# Altium schematic sheet Ecran.SchDoc
size A
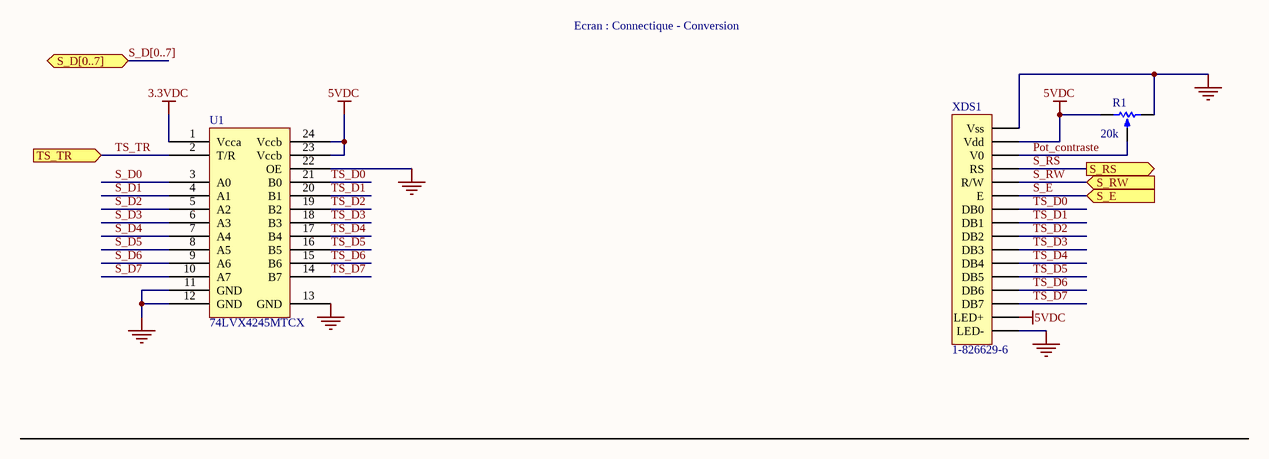
[diagram p0: Ecran.SchDoc]

## Parts
R1  20k  [VR5]
U1  74LVX4245MTCX
XDS1  1-826629-6  [HDR1X16]

## Ports
S_D[0..7] (bidir), S_E (in), S_RS (out), S_RW (in), TS_TR (in)

## Nets
3.3VDC: U1.1(Vcca)
5VDC: R1.1(TOP) U1.23(Vccb) U1.24(Vccb) XDS1.2(Vdd) XDS1.15(LED+)
GND: R1.2(BOT) U1.11(GND) U1.12(GND) U1.13(GND) U1.22(OE) XDS1.1(Vss) XDS1.16(LED-)
Pot_contraste: R1.3(TAP) XDS1.3(V0)
S_D0: U1.3(A0)
S_D1: U1.4(A1)
S_D2: U1.5(A2)
S_D3: U1.6(A3)
S_D4: U1.7(A4)
S_D5: U1.8(A5)
S_D6: U1.9(A6)
S_D7: U1.10(A7)
S_E: XDS1.6(E) ; port S_E
S_RS: XDS1.4(RS) ; port S_RS
S_RW: XDS1.5(R/W) ; port S_RW
TS_D0: U1.21(B0) XDS1.7(DB0)
TS_D1: U1.20(B1) XDS1.8(DB1)
TS_D2: U1.19(B2) XDS1.9(DB2)
TS_D3: U1.18(B3) XDS1.10(DB3)
TS_D4: U1.17(B4) XDS1.11(DB4)
TS_D5: U1.16(B5) XDS1.12(DB5)
TS_D6: U1.15(B6) XDS1.13(DB6)
TS_D7: U1.14(B7) XDS1.14(DB7)
TS_TR: U1.2(T/R) ; port TS_TR

## Buses and harness runs
bus S_D[0..7] = port S_D[0..7]

## Notes on the sheet
- Ecran : Connectique - Conversion

## Library data of the parts
R1 = RPot: Potentiometer; Fournisseur: Farnell; Ref.Fournisseur: 9609822; Ref.Fabricant: M63S203KB40; Fabricant: VISHAY
U1 = 74LVX4245MTCX: Bus Transceiver; Fabricant: ON SEMICONDUCTOR; Fournisseur: Farnell; Ref.Fournisseur: 1467357; Ref.Fabricant: 74LVX4245MTCX
XDS1 = Header 16: Header, 16-Pin; Fournisseur: Farnell; Fabricant: AMP-TE CONNECTIVITY; Ref.Fournisseur: 1248124; Ref.Fabricant: 1-826629-6